# Altium project keyboard_main.PrjPcb
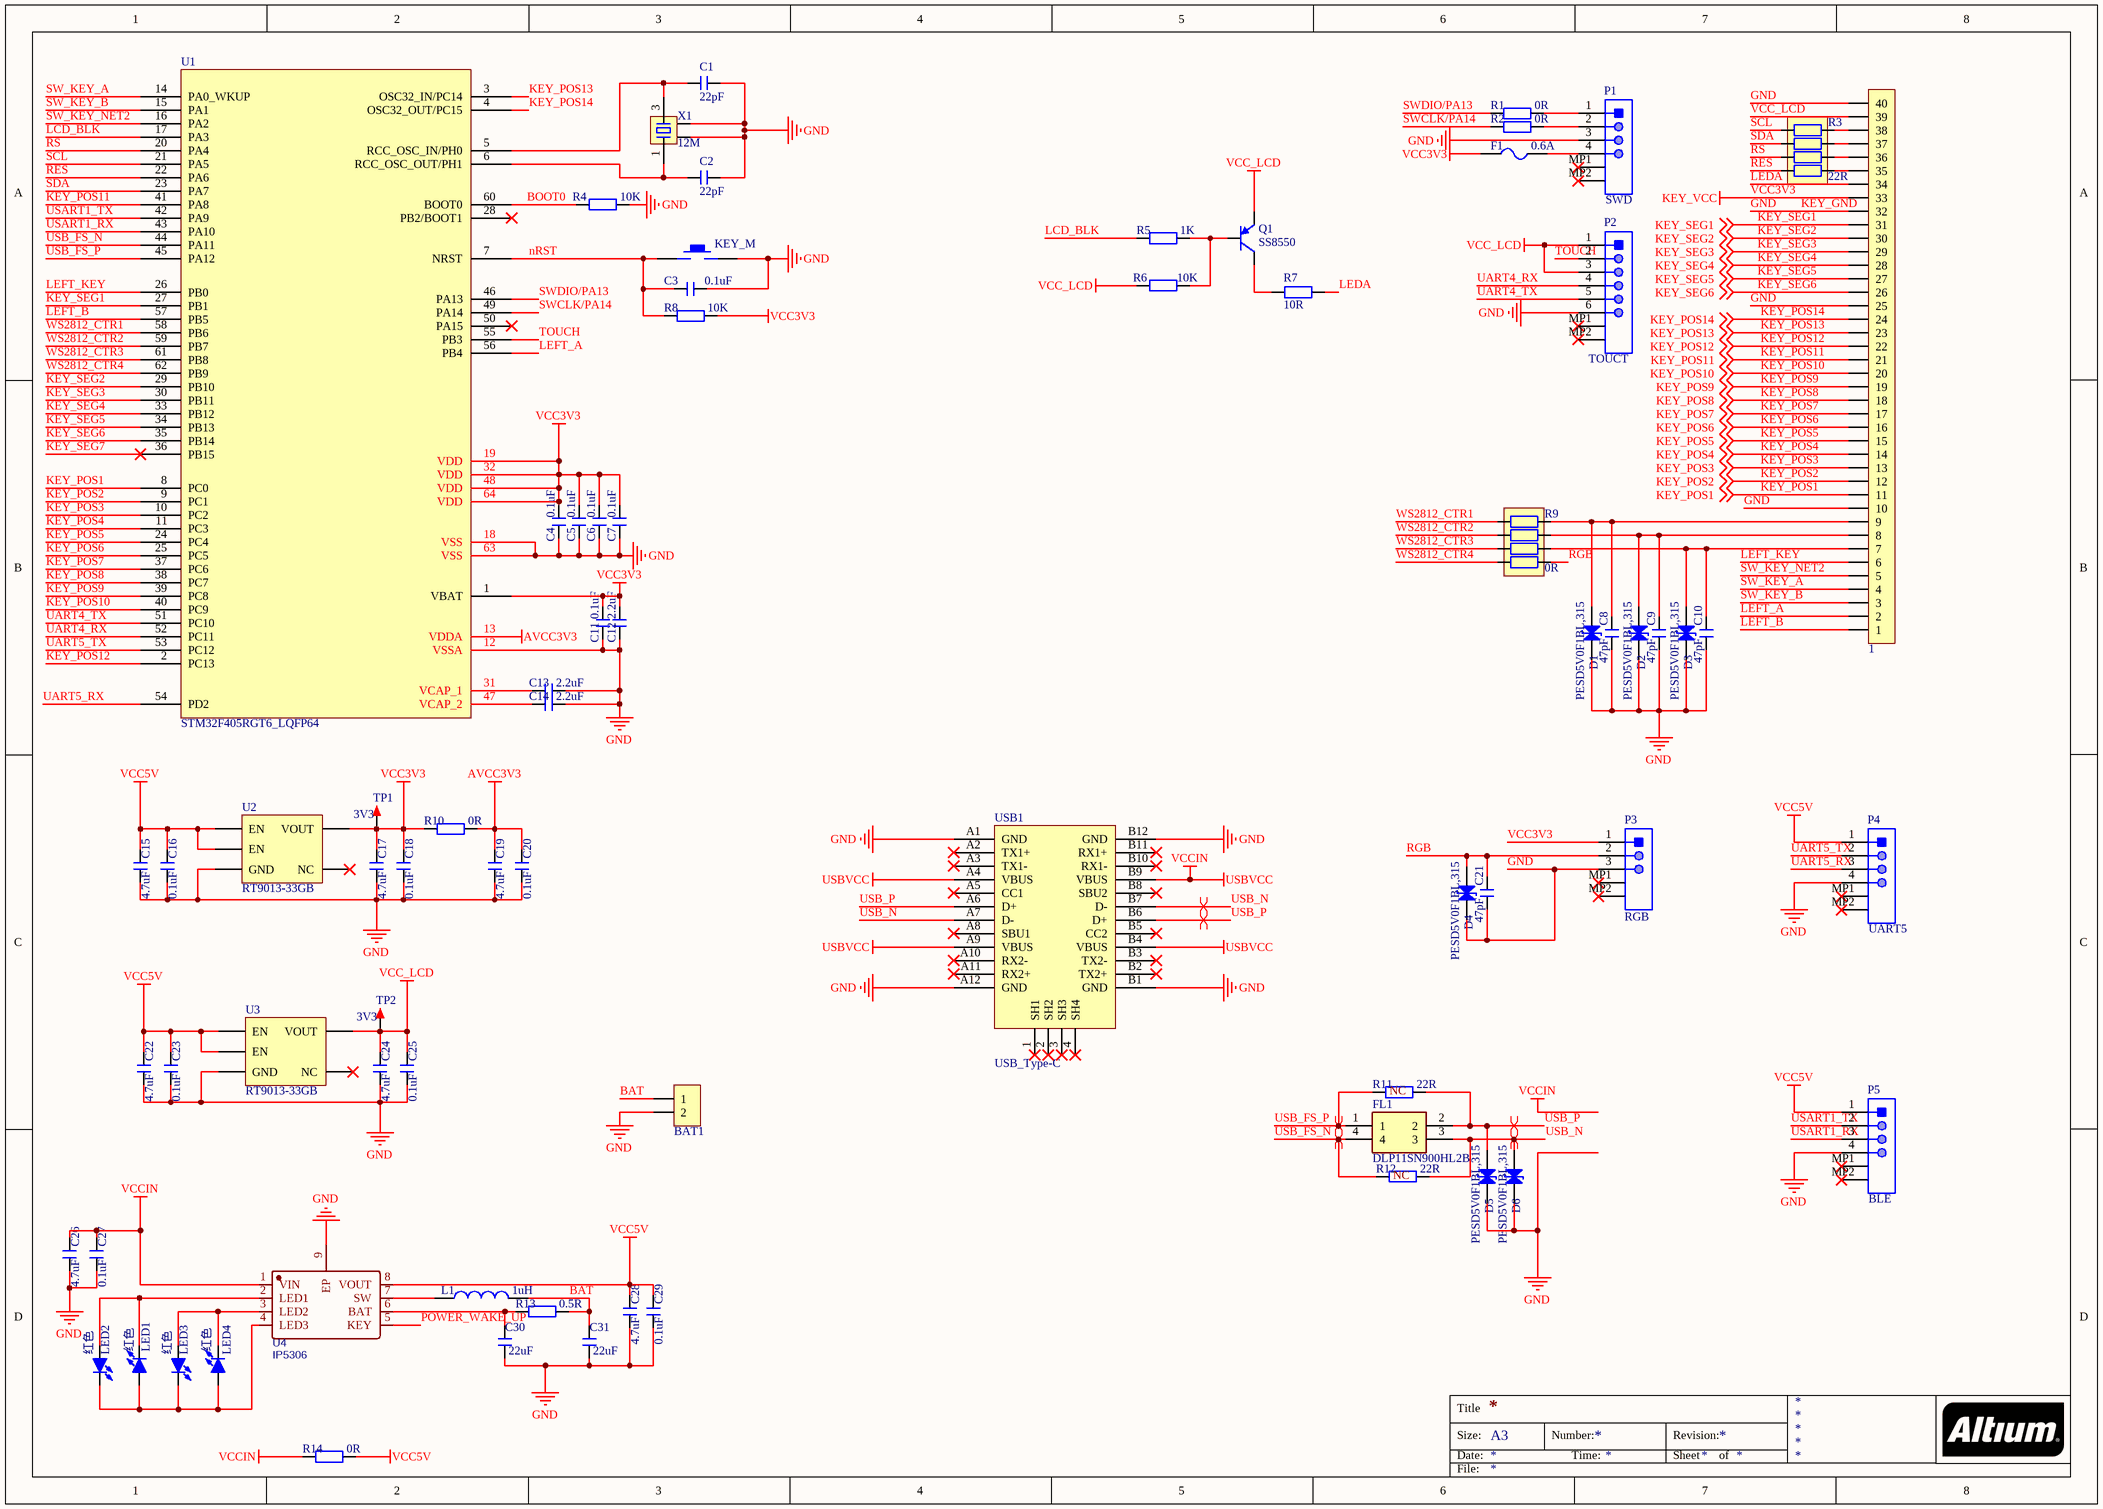
[diagram p0: keyboard_main.SchDoc]
1 sheet, 75 parts. Net scope: global (net labels, ports and power ports of the same name join across sheets).
Board files: keyboard_main.PcbDoc, dxf.PcbDoc

## Sheet keyboard_main.SchDoc
size A3

### Parts
1  FPC1.0-40P  [FPC0.5 2H-WS-40P]  (value not drawn)
BAT1  HDR-1X2  [XH2.54-WI-2P]  (value not drawn)
C1  22pF  [C 0402_L]
C2  22pF  [C 0402_L]
C3  0.1uF  [C 0402_L]
C4  0.1uF  [C 0402_L]
C5  0.1uF  [C 0402_L]
C6  0.1uF  [C 0402_L]
C7  0.1uF  [C 0402_L]
C8  47pF  [C 0402_L]
C9  47pF  [C 0402_L]
C10  47pF  [C 0402_L]
C11  0.1uF  [C 0402_L]
C12  2.2uF  [C 0402_L]
C13  2.2uF  [C 0402_L]
C14  2.2uF  [C 0402_L]
C15  4.7uF  [C 0402_L]
C16  0.1uF  [C 0402_L]
C17  4.7uF  [C 0402_L]
C18  0.1uF  [C 0402_L]
C19  4.7uF  [C 0402_L]
C20  0.1uF  [C 0402_L]
C21  47pF  [C 0402_L]
C22  4.7uF  [C 0402_L]
C23  0.1uF  [C 0402_L]
C24  4.7uF  [C 0402_L]
C25  0.1uF  [C 0402_L]
C26  4.7uF  [C 0402_L]
C27  0.1uF  [C 0402_L]
C28  4.7uF  [C 0402_L]
C29  0.1uF  [C 0402_L]
C30  22uF  [C 0603_L]
C31  22uF  [C 0603_L]
D1  PESD5V0F1BL,315  [SOD-882_L1.0-W0.6-BI]
D2  PESD5V0F1BL,315  [SOD-882_L1.0-W0.6-BI]
D3  PESD5V0F1BL,315  [SOD-882_L1.0-W0.6-BI]
D4  PESD5V0F1BL,315  [SOD-882_L1.0-W0.6-BI]
D5  PESD5V0F1BL,315  [SOD-882_L1.0-W0.6-BI]
D6  PESD5V0F1BL,315  [SOD-882_L1.0-W0.6-BI]
F1  0.6A  [FU 0402]
FL1  DLP11SN900HL2B  [DLP11SA350HL2B]
L1  1uH  [L 1812]
LED1  红色  [LED 0805G]
LED2  红色  [LED 0805G]
LED3  红色  [LED 0805G]
LED4  红色  [LED 0805G]
P1  SWD  [JST-SM04B-GHS-TB_V]
P2  TOUCT  [JST-SM06B-GHS-TB_V]
P3  RGB  [JST-SM03B-GHS-TB_V]
P4  UART5  [JST-SM04B-GHS-TB_V]
P5  BLE  [JST-SM04B-GHS-TB_V]
Q1  SS8550  [SOT23-3N]
R1  0R  [R 0402_L]
R2  0R  [R 0402_L]
R3  22R  [RCA-8P4R-0402]
R4  10K  [R 0402_L]
R5  1K  [R 0402_L]
R6  10K  [R 0402_L]
R7  10R  [R 0402_L]
R8  10K  [R 0402_L]
R9  0R  [RCA-8P4R-0402]
R10  0R  [R 0402_L]
R11  22R  [R 0402_L]
R12  22R  [R 0402_L]
R13  0.5R  [R 0603_L]
R14  0R  [R 0805_L]
RST1  KEY_M  [SMD-3.2*4.2]
TP1  3V3  [TEST 1]
TP2  3V3  [TEST 1]
U1  STM32F405RGT6_LQFP64  [LQFP-64_10X10X05P]
U2  RT9013-33GB  [SOT23-5M]
U3  RT9013-33GB  [SOT23-5M]
U4  IP5306  [SOP-8_EP_150mil]
USB1  USB_Type-C  [Type-C-TOP]
X1  12M  [OSC 3225-4P]

### Nets
AVCC3V3: C19.1 C20.1 R10.2 U1.13(VDDA)
GND: 1.10 1.25 1.32 1.40 BAT1.2 C1.2 C2.2 C3.2 C4.1 C5.1 C6.1 C7.1 C8.1 C9.1 C10.1 C11.1 C12.1 C13.1 C14.1 C15.2 C16.2 C17.2 C18.2 C19.2 C20.2 C21.1 C22.2 C23.2 C24.2 C25.2 C26.2 C27.2 C28.2 C29.2 C30.1 C31.2 D1.2(K) D2.2(K) D3.2(K) D4.2(K) D5.2(K) D6.2(K) P1.3 P2.6 P3.3 P4.4 P5.4 R4.2 RST1.2 U1.12(VSSA) U1.18(VSS) U1.63(VSS) U2.2(GND) U3.2(GND) U4.9(EP) USB1.A1(GND) USB1.A12(GND) USB1.B1(GND) USB1.B12(GND) X1.2 X1.4  [also labelled KEY_GND]
USBVCC: C26.1 C27.1 R14.1 U4.1(VIN) USB1.A4(VBUS) USB1.A9(VBUS) USB1.B4(VBUS) USB1.B9(VBUS)  [also labelled VCCIN]
VCC3V3: 1.33 C4.2 C5.2 C6.2 C7.2 C11.2 C12.2 C17.1 C18.1 F1.1 P3.1 R8.2 R10.1 TP1.1 U1.1(VBAT) U1.19(VDD) U1.32(VDD) U1.48(VDD) U1.64(VDD) U2.5(VOUT)  [also labelled KEY_VCC]
VCC5V: C15.1 C16.1 C22.1 C23.1 C28.1 C29.1 P4.1 P5.1 R14.2 U2.1(EN) U2.3(EN) U3.1(EN) U3.3(EN) U4.8(VOUT)
VCC_LCD: 1.39 C24.1 C25.1 P2.1 P2.3 Q1.2(E) R6.2 TP2.1 U3.5(VOUT)
BAT: BAT1.1 C31.1 L1.2 R13.2
BOOT0: R4.1 U1.60(BOOT0)
KEY_POS1: 1.11 U1.8(PC0) ; off-sheet KEY_POS1
KEY_POS2: 1.12 U1.9(PC1) ; off-sheet KEY_POS2
KEY_POS3: 1.13 U1.10(PC2) ; off-sheet KEY_POS3
KEY_POS4: 1.14 U1.11(PC3) ; off-sheet KEY_POS4
KEY_POS5: 1.15 U1.24(PC4) ; off-sheet KEY_POS5
KEY_POS6: 1.16 U1.25(PC5) ; off-sheet KEY_POS6
KEY_POS7: 1.17 U1.37(PC6) ; off-sheet KEY_POS7
KEY_POS8: 1.18 U1.38(PC7) ; off-sheet KEY_POS8
KEY_POS9: 1.19 U1.39(PC8) ; off-sheet KEY_POS9
KEY_POS10: 1.20 U1.40(PC9) ; off-sheet KEY_POS10
KEY_POS11: 1.21 U1.41(PA8) ; off-sheet KEY_POS11
KEY_POS12: 1.22 U1.2(PC13) ; off-sheet KEY_POS12
KEY_POS13: 1.23 U1.3(OSC32_IN/PC14) ; off-sheet KEY_POS13
KEY_POS14: 1.24 U1.4(OSC32_OUT/PC15) ; off-sheet KEY_POS14
KEY_SEG1: 1.31 U1.27(PB1) ; off-sheet KEY_SEG1
KEY_SEG2: 1.30 U1.29(PB10) ; off-sheet KEY_SEG2
KEY_SEG3: 1.29 U1.30(PB11) ; off-sheet KEY_SEG3
KEY_SEG4: 1.28 U1.33(PB12) ; off-sheet KEY_SEG4
KEY_SEG5: 1.27 U1.34(PB13) ; off-sheet KEY_SEG5
KEY_SEG6: 1.26 U1.35(PB14) ; off-sheet KEY_SEG6
KEY_SEG7: U1.36(PB15)
LCD_BLK: R5.1 U1.17(PA3)
LEDA: 1.34 R7.1
LEFT_A: 1.2 U1.56(PB4)
LEFT_B: 1.1 U1.57(PB5)
LEFT_KEY: 1.6 U1.26(PB0)
nRST: C3.1 R8.1 RST1.1 U1.7(NRST)
POWER_WAKE_UP: U4.5(KEY)
RES: R3.4 U1.22(PA6)
RGB: C21.2 D4.1(A) P3.2 R9.5
RS: R3.3 U1.20(PA4)
SCL: R3.1 U1.21(PA5)
SDA: R3.2 U1.23(PA7)
SW_KEY_A: 1.4 U1.14(PA0_WKUP)
SW_KEY_B: 1.3 U1.15(PA1)
SW_KEY_NET2: 1.5 U1.16(PA2)
SWCLK/PA14: R2.1 U1.49(PA14)
SWDIO/PA13: R1.1 U1.46(PA13)
TOUCH: P2.2 U1.55(PB3)
UART4_RX: P2.4 U1.52(PC11)
UART4_TX: P2.5 U1.51(PC10)
UART5_RX: P4.3 U1.54(PD2)
UART5_TX: P4.2 U1.53(PC12)
USART1_RX: P5.3 U1.43(PA10)
USART1_TX: P5.2 U1.42(PA9)
USB_FS_N: FL1.4 R12.1 U1.44(PA11)
USB_FS_P: FL1.1 R11.1 U1.45(PA12)
USB_N: D6.1(A) FL1.3 R12.2 USB1.A7(D-) USB1.B7(D-)
USB_P: D5.1(A) FL1.2 R11.2 USB1.A6(D+) USB1.B6(D+)
WS2812_CTR1: R9.1 U1.58(PB6)
WS2812_CTR2: R9.2 U1.59(PB7)
WS2812_CTR3: R9.3 U1.61(PB8)
WS2812_CTR4: R9.4 U1.62(PB9)
Net1_7: 1.7 C10.2 D3.1(A) R9.6
Net1_8: 1.8 C9.2 D2.1(A) R9.7
Net1_9: 1.9 C8.2 D1.1(A) R9.8
Net1_35: 1.35 R3.5
Net1_36: 1.36 R3.6
Net1_37: 1.37 R3.7
Net1_38: 1.38 R3.8
NetC1_1: C1.1 U1.5(RCC_OSC_IN/PH0) X1.3
NetC2_1: C2.1 U1.6(RCC_OSC_OUT/PH1) X1.1
NetC13_2: C13.2 U1.31(VCAP_1)
NetC14_2: C14.2 U1.47(VCAP_2)
NetC30_2: C30.2 R13.1 U4.6(BAT)
NetF1_2: F1.2 P1.4
NetL1_1: L1.1 U4.7(SW)
NetLED1_1: LED1.1(A) LED2.2(K) LED3.2(K) LED4.1(A) U4.4(LED3)
NetLED1_2: LED1.2(K) LED2.1(A) U4.2(LED1)
NetLED3_1: LED3.1(A) LED4.2(K) U4.3(LED2)
NetP1_1: P1.1 R1.2
NetP1_2: P1.2 R2.2
NetQ1_1: Q1.1(B) R5.2 R6.1
NetQ1_3: Q1.3(C) R7.2

Not connected (* = marked no-connect by the designer): P1 MP1* MP2*; P2 MP1* MP2*; P3 MP1* MP2*; P4 MP1* MP2*; P5 MP1* MP2*; U1 28(PB2/BOOT1)* 50(PA15)*; U2 4(NC)*; U3 4(NC)*; USB1 1(SH1)* 2(SH2)* 3(SH3)* 4(SH4)* A2(TX1+)* A3(TX1-)* A5(CC1)* A8(SBU1)* A10(RX2-)* A11(RX2+)* B2(TX2+)* B3(TX2-)* B5(CC2)* B8(SBU2)* B10(RX1-)* B11(RX1+)*

### Layout directives
differential pair: USB_FS_N, USB_FS_P, USB_N, USB_P

### Notes on the sheet
- (near R11) NC
- (near R12) NC
- Title
- Size:
- Date:
- A3
- Number:
- Time:
- Revision:
- Sheet
- of
- File:

### Library data of the parts
1 = FPC-40P: FPC连接器; 版权归属: 黎明电子style; BOM名称: FPC连接器; 学习资源: https://lmdzstyle.taobao.com/
BAT1 = Header 2: 2P接插件
C1-C31 = C: 贴片电容
D1-D6 = PESD5V0F1BL,315: PESD5V0F1BL,315、ESD二极管、5.5V
F1 = FU: 贴片保险丝
FL1 = DLP11SN900HL2B: Filter; Manufacturer_Name: Murata Electronics; Datasheet Link: https://www.murata.com/en-us/products/productdetail?partno=DLP11SN900HL2%23; Height: 0.92mm; Manufacturer_Part_Number: DLP11SN900HL2B; Mouser Part Number: 81-DLP11SN900HL2B; Mouser Price/Stock: https://www.mouser.co.uk/ProductDetail/Murata-Electronics/DLP11SN900HL2B?qs=%2F%252BYoplLUB5ikZtvOhZcMEg%3D%3D
L1 = L: 小功率贴片电感
LED1-LED4 = LED-SMD: 贴片LED
P1 P4 P5 = SM04B-GHS-TB(LF)(SN): GH Disconnectable Crimp Style Connector, Pitch 1.25 mm, 1 x 4 Position, Height 4.25 mm, -25 to 85 degC, RoHS, Tape and Reel; Manufacturer: JST; No of Positions: 4; Pitch: 1.25mm; Style/Orientation: RightAngleHeader/Plug; Package Reference: SM04B-GHS-TB; Type: WiretoBoard; Datasheet URL: http://www.jst-mfg.com/product/pdf/eng/eGH.pdf; Termination: Crimp; Manufacturer URL: http://www.jst.com/home2.html; Mounting Technology: SurfaceMount; Datasheet Version: 05/2016; Package Description: GH Disconnectable Crimp Style Connector, Pitch 1.25 mm, 1 x 4 Position, Height 4.25 mm
P2 = SM06B-GHS-TB(LF)(SN): GH Disconnectable Crimp Style Connector, Pitch 1.25 mm, 1 x 6 Position, Height 4.25 mm, -25 to 85 degC, RoHS, Tape and Reel; Manufacturer: JST; No of Positions: 6; Pitch: 1.25mm; Style/Orientation: RightAngleHeader/Plug; Package Reference: SM06B-GHS-TB; Type: WiretoBoard; Datasheet URL: http://www.jst-mfg.com/product/pdf/eng/eGH.pdf; Termination: Crimp; Manufacturer URL: http://www.jst.com/home2.html; Mounting Technology: SurfaceMount; Datasheet Version: 05/2016; Package Description: GH Disconnectable Crimp Style Connector, Pitch 1.25 mm, 1 x 6 Position, Height 4.25 mm
P3 = SM03B-GHS-TB(LF)(SN): GH Disconnectable Crimp Style Connector, Pitch 1.25 mm, 1 x 3 Position, Height 4.25 mm, -25 to 85 degC, RoHS, Tape and Reel; Manufacturer: JST; No of Positions: 3; Pitch: 1.25mm; Style/Orientation: RightAngleHeader/Plug; Package Reference: SM03B-GHS-TB; Type: WiretoBoard; Datasheet URL: http://www.jst-mfg.com/product/pdf/eng/eGH.pdf; Termination: Crimp; Manufacturer URL: http://www.jst.com/home2.html; Mounting Technology: SurfaceMount; Datasheet Version: 05/2016; Package Description: GH Disconnectable Crimp Style Connector, Pitch 1.25 mm, 1 x 3 Position, Height 4.25 mm
Q1 = 8550-SMD: 高频放大-PNP型
R1 R2 R4-R8 R10-R14 = R: 贴片电阻
R3 R9 = R-8P4R: 贴片排阻
TP1 TP2 = TEST: 测试点
U4 = IP5306: BOM_Manufacturer: INJOINIC; Contributor: LCSC; BOM_Supplier: LCSC; BOM_Supplier Part: C181692; BOM_Manufacturer Part: IP5306; BOM_JLCPCB Part Class: Extended Part; spicePre: U; spiceSymbolName: IP5306
X1 = XTAL-4P: 4脚无源晶振